# EAGLE design MotorSpeedController (EAGLE 9.4.0)
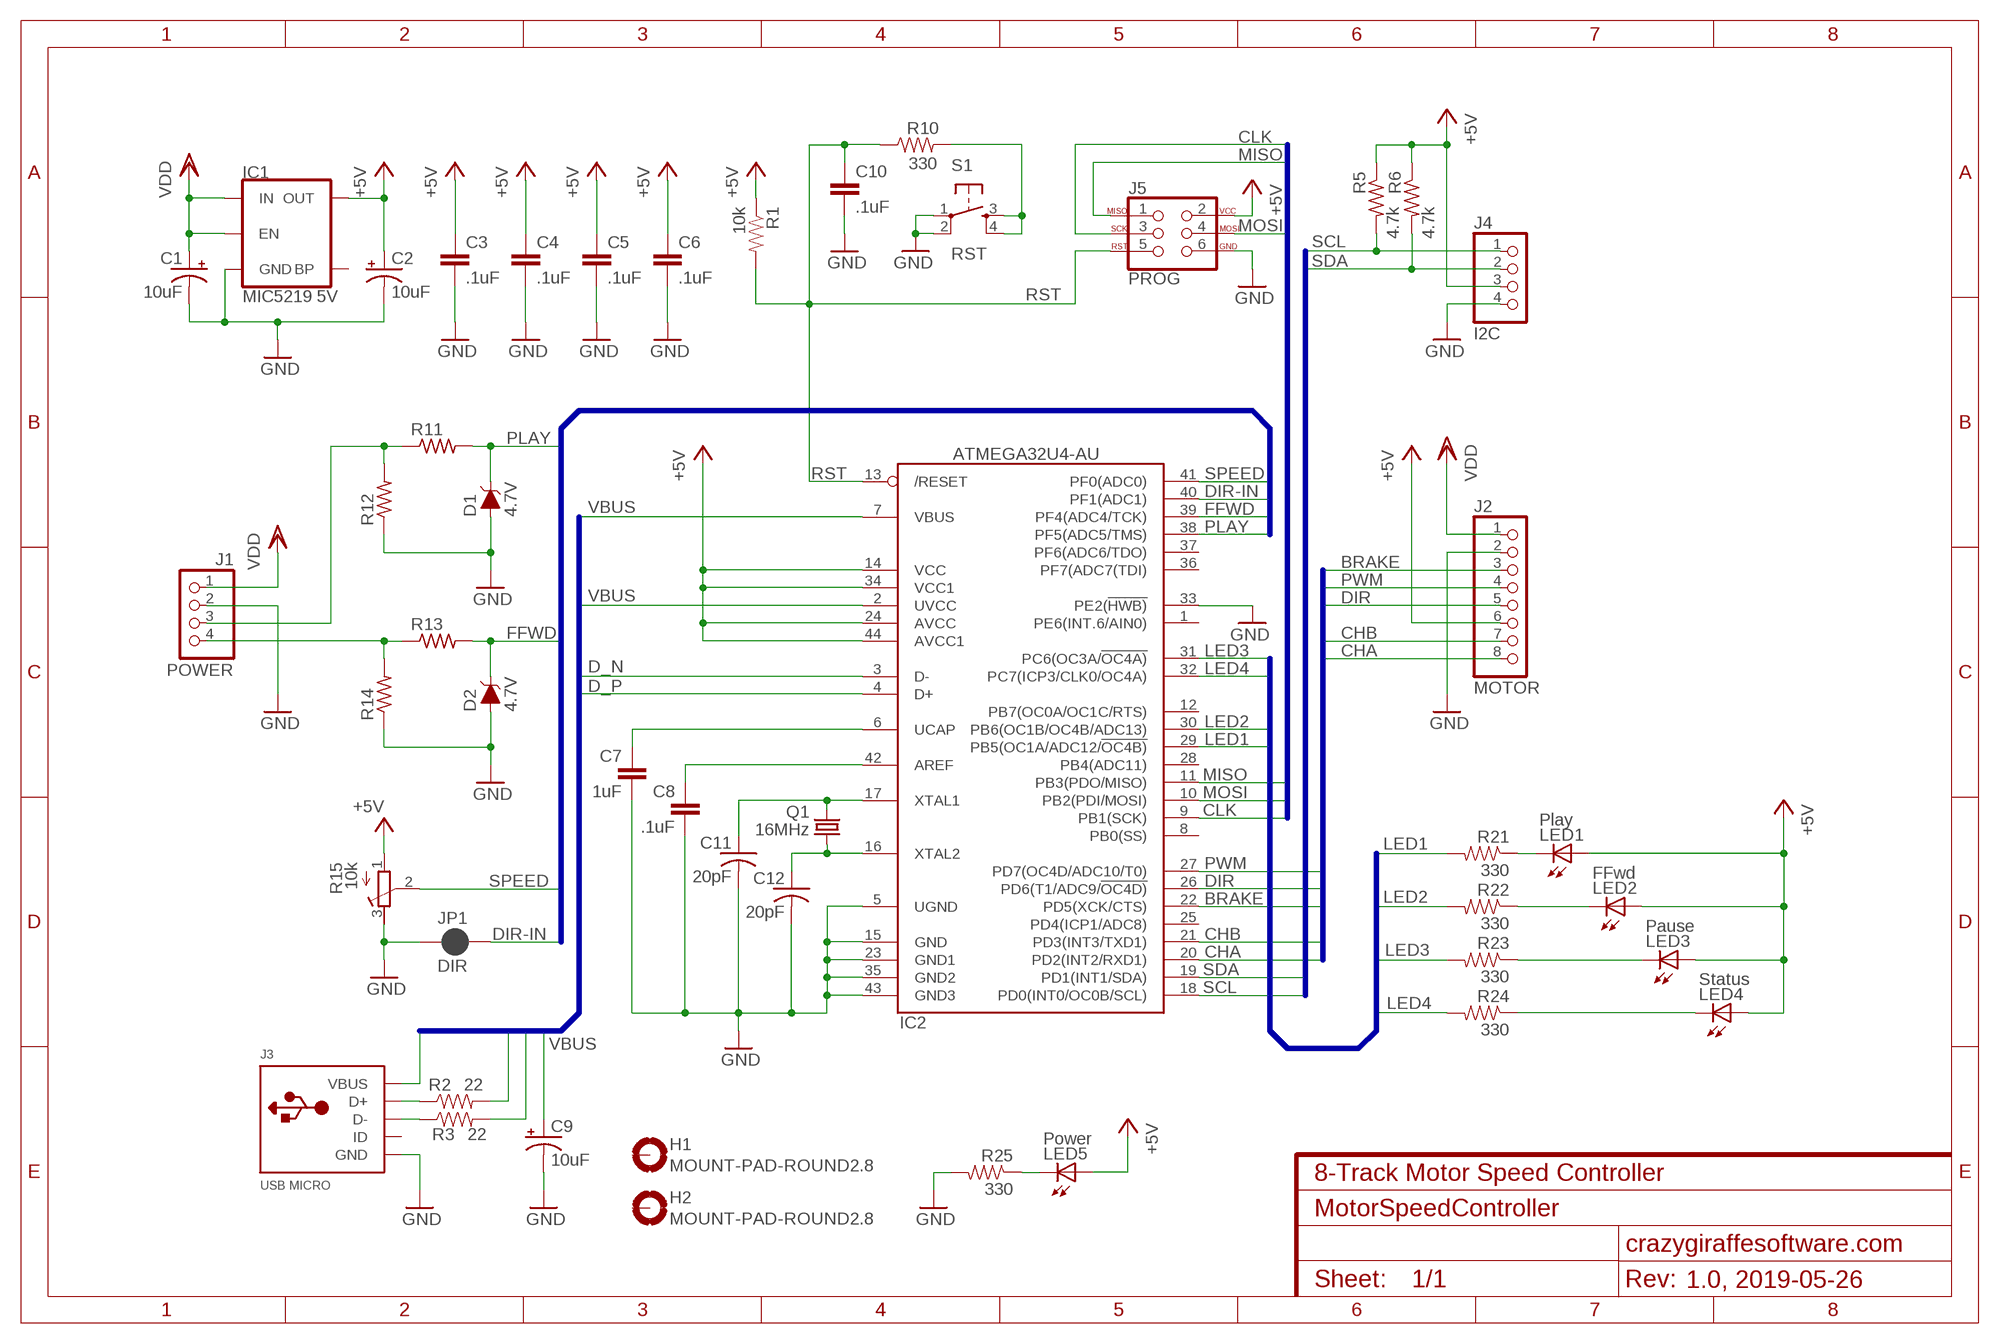
[diagram p0: schematic, sheet 1]
FRAME1 (FRAME-A4L): CNAME: 8-Track Motor Speed Controller; CREVISION: 1.0, 2019-05-26; DESIGNER: crazygiraffesoftware.com

## Parts
C1  10uF  CPOL-USB  [PANASONIC_B]
C2  10uF  CPOL-USB  [PANASONIC_B]
C3  .1uF  CAP0603-CAP  [0603-CAP]
C4  .1uF  CAP0603-CAP  [0603-CAP]
C5  .1uF  CAP0603-CAP  [0603-CAP]
C6  .1uF  CAP0603-CAP  [0603-CAP]
C7  1uF  CAP0603-CAP  [0603-CAP]
C8  .1uF  CAP0603-CAP  [0603-CAP]
C9  10uF  CPOL-USB  [PANASONIC_B]
C10  .1uF  CAP0603-CAP  [0603-CAP]
C11  20pF  C-US025-030X050  [C025-030X050]
C12  20pF  C-US025-030X050  [C025-030X050]
D1  4.7V  DIODE-ZENER-BZT52C3V6S  [SOD-323]
D2  4.7V  DIODE-ZENER-BZT52C3V6S  [SOD-323]
H1  MOUNT-PAD-ROUND2.8  [2,8-PAD]
H2  MOUNT-PAD-ROUND2.8  [2,8-PAD]
IC1  MIC5219 5V  V_REG_MIC52195V  [SOT23-5]
IC2  ATMEGA32U4-AU  [TQFP44]
J1  POWER  PINHD-1X4  [1X04]
J2  MOTOR  PINHD-1X8  [1X08]
J3  USB MICRO  MICROBUILDER_USB_MICRO_20329_V2  [MICROBUILDER_4UCONN_20329_V2]
J4  I2C  PINHD-1X4  [1X04]
J5  PROG  AVR_SPI_PROG_3X2PTH  [2X3]
JP1  DIR  JUMPER-SMT_2_NC_PASTE_SILK  [SMT-JUMPER_2_NC_PASTE_SILK]
LED1  Play  LED0603  [LED-0603]
LED2  FFwd  LED0603  [LED-0603]
LED3  Pause  LED0603  [LED-0603]
LED4  Status  LED0603  [LED-0603]
LED5  Power  LED0603  [LED-0603]
Q1  16MHz  CRYSTALHC49S  [HC49/S]
R1  10k  RESISTOR0603-RES  [0603-RES]
R2  22  RESISTOR0603-RES  [0603-RES]
R3  22  RESISTOR0603-RES  [0603-RES]
R5  4.7k  R-US_R0603  [R0603]
R6  4.7k  R-US_R0603  [R0603]
R10  330  RESISTOR0603-RES  [0603-RES]
R11  R-US_R0603  [R0603]
R12  R-US_R0603  [R0603]
R13  R-US_R0603  [R0603]
R14  R-US_R0603  [R0603]
R15  10k  R-TRIMM3296Y  [RTRIM3296Y]
R21  330  RESISTOR0603-RES  [0603-RES]
R22  330  RESISTOR0603-RES  [0603-RES]
R23  330  RESISTOR0603-RES  [0603-RES]
R24  330  RESISTOR0603-RES  [0603-RES]
R25  330  RESISTOR0603-RES  [0603-RES]
S1  RST  TAC_SWITCHSMD  [TACTILE_SWITCH_SMD]

## Nets
+5V: C2.+ C3.1 C4.1 C5.1 C6.1 IC1.5(OUT) IC2.14(VCC) IC2.24(AVCC) IC2.34(VCC1) IC2.44(AVCC1) J2.6 J4.3 J5.2 LED1.A LED2.A LED3.A LED4.A LED5.A R1.1 R5.1 R6.1 R15.1(A)
+PWR: C1.+ IC1.1(IN) IC1.3(EN) J1.1 J2.1 ; supply symbol labelled VDD
BRAKE: IC2.22(PD5(XCK/CTS)) J2.3
CD_N [diff pairs]: J3.D- R3.1
CD_P [diff pairs]: J3.D+ R2.1
CHA: IC2.20(PD2(INT2/RXD1)) J2.8
CHB: IC2.21(PD3(INT3/TXD1)) J2.7
CLK: IC2.9(PB1(SCK)) J5.3
D_N [diff pairs]: IC2.3(D-) R3.2
D_P [diff pairs]: IC2.4(D+) R2.2
DIR: IC2.26(PD6(T1/ADC9/!OC4D)) J2.5
DIR-IN: IC2.40(PF1(ADC1)) JP1.2
FFWD: D2.C IC2.39(PF4(ADC4/TCK)) R13.2
GND: C1.- C2.- C3.2 C4.2 C5.2 C6.2 C7.2 C8.2 C9.- C10.2 C11.2 C12.2 D1.A D2.A IC1.2(GND) IC2.5(UGND) IC2.15(GND) IC2.23(GND1) IC2.33(PE2(!HWB)) IC2.35(GND2) IC2.43(GND3) J1.2 J2.2 J3.BASE@1(GND) J3.BASE@2(GND) J3.GND J3.SPRT@1(GND) J3.SPRT@2(GND) J3.SPRT@3(GND) J3.SPRT@4(GND) J4.4 J5.6 JP1.1 R12.1 R14.1 R15.3(E) R25.2 S1.1 S1.2
LED1: IC2.29(PB5(OC1A/ADC12/!OC4B)) R21.2
LED2: IC2.30(PB6(OC1B/OC4B/ADC13)) R22.2
LED3: IC2.31(PC6(OC3A/!OC4A)) R23.2
LED4: IC2.32(PC7(ICP3/CLK0/OC4A)) R24.2
MISO: IC2.11(PB3(PDO/MISO)) J5.1
MOSI: IC2.10(PB2(PDI/MOSI)) J5.4
N$1: LED3.C R23.1
N$2: C8.1 IC2.42(AREF)
N$3: C11.1 IC2.17(XTAL1) Q1.2
N$4: R10.2 S1.3 S1.4
N$5: C7.1 IC2.6(UCAP)
N$6: LED4.C R24.1
N$7: C12.1 IC2.16(XTAL2) Q1.1
N$10: J1.4 R13.1 R14.2
N$11: LED5.C R25.1
N$13: J1.3 R11.1 R12.2
N$20: LED1.C R21.1
PLAY: D1.C IC2.38(PF5(ADC5/TMS)) R11.2
PWM: IC2.27(PD7(OC4D/ADC10/T0)) J2.4
R22: LED2.C R22.1
RST: C10.1 IC2.13(/RESET) J5.5 R1.2 R10.1
SCL: IC2.18(PD0(INT0/OC0B/SCL)) J4.1 R5.2
SDA: IC2.19(PD1(INT1/SDA)) J4.2 R6.2
SPEED: IC2.41(PF0(ADC0)) R15.2(S)
VBUS: C9.+ IC2.2(UVCC) IC2.7(VBUS) J3.VBUS
Unconnected: H1.B2,8(MOUNT) H2.B2,8(MOUNT) IC1.4(BP) IC2.1(PE6(INT.6/AIN0)) IC2.8(PB0(SS)) IC2.12(PB7(OC0A/OC1C/RTS)) IC2.25(PD4(ICP1/ADC8)) IC2.28(PB4(ADC11)) IC2.36(PF7(ADC7(TDI)) IC2.37(PF6(ADC6/TDO)) J3.ID

## Buses
INS:DIR-IN,FFWD,PLAY,SPEED
MOTOR:BRAKE,CHA,CHB,DIR,PWM
SPI:CLK,CS,MISO,MOSI
I2C:SCL,SDA
LEDS:LED1,LED2,LED3,LED4
USB:D_N,D_P,VBUS

## Library data of the parts
C1 C2 C9 = rcl:CPOL-US: POLARIZED CAPACITOR, American symbol; SPICEPREFIX: C
C3-C8 C10 = SparkFun-Passives:CAP: Capacitor Standard 0603 ceramic capacitor, and 0.1" leaded capacitor.
C11 C12 = adafruit:C-US: CAPACITOR, American symbol
D1 D2 = SparkFun-DiscreteSemi:DIODE-ZENER: Zener Diode A Zener diode allows current to flow from its anode to its cathode like a normal semiconductor diode, but it also permits current to flow in the reverse direction when its "Zener voltage" is reached. - WIkipedia; PROD_ID: DIO-08199; SPICEPREFIX: D; VALUE: 3.6V
H1 H2 = holes:MOUNT-PAD-ROUND: MOUNTING PAD, round
IC1 = SparkFun-IC-Power:V_REG_MIC5219: V_REG MIC5219 Standard 3.3V and 5V 500mA LDO voltage regulator in SOT-23 layout. Micrel part MIC5219. BP (by-pass) pin is used to lower output noise with 470pF cap, may be left open.; PROD_ID: VREG-10107
IC2 = adafruit:ATMEGA32U4: http://www.ladyada.net/library/eagle
J1 = pinhead:PINHD-1X4: PIN HEADER; SPICEPREFIX: E
J2 = pinhead:PINHD-1X8: PIN HEADER
J3 = NidecController:MICROBUILDER_USB: USB Connectors USBMINIB - Surface Mount Female Mini-B USB Connector 4UConnector: 06564
J4 = pinhead:PINHD-1X4: PIN HEADER
J5 = SparkFun-Connectors:AVR_SPI_PROG_3X2: AVR ISP 6 Pin This is the reduced ISP connector for AVR programming. Common on Arduino. This footprint will take up less PCB space and can be used with a 10-pin to 6-pin adapter such as SKU: BOB-08508 **Special note about "TEST_POINT" package. The stop mask is on the top side, so if you want your programming test points to be on the bottom of your board, make sure to place this package on the bottom side of the board. This also ensure that the orientation to program from the bottom side will be correct. SparkFun Products: SparkFun ISP Pogo Adapter <https://www.sparkfun.com/products/11591> - NS Tiny AVR Programmer <https://www.sparkfun.com/products/11801> -PTH
JP1 = SparkFun-Jumpers:JUMPER-SMT_2_NC_PASTE: Normally closed solder jumper This jumper has an aperture in the stencil to allow solder paste to bridge the split in the wire so it's normally closed (NC). Wick off the solder to open the connection. Reapply solder to reclose the connection.; SPICEPREFIX: B
LED1-LED5 = SparkFun-LED:LED: LEDs Standard schematic elements and footprints for 5mm, 3mm, 1206, and 0603 sized LEDs. 5mm - Spark Fun Electronics SKU : COM-00529 (and others)
Q1 = adafruit:CRYSTAL: CRYSTAL; OC_FARNELL: 1667008; OC_NEWARK: unknown
R1-R3 R10 R21-R25 = SparkFun-Passives:RESISTOR: Resistor Basic schematic elements and footprints for 0603, 1206, and PTH resistors.
R5 R6 R11-R14 = rcl:R-US_: RESISTOR, American symbol; SPICEPREFIX: R
R15 = rcl:R-TRIMM: Trimm resistor; SPICEMODEL: X; SPICEPREFIXL: POT
S1 = SparkFun-Electromechanical:TAC_SWITCH: Momentary Switch Button commonly used for reset or general input. Spark Fun Electronics SKU : COM-00097

## Net classes
1 vcc: width 0.254 mm
2 gnd: width 0.254 mm
3 diff pairs: width 0.152 mm

## Board
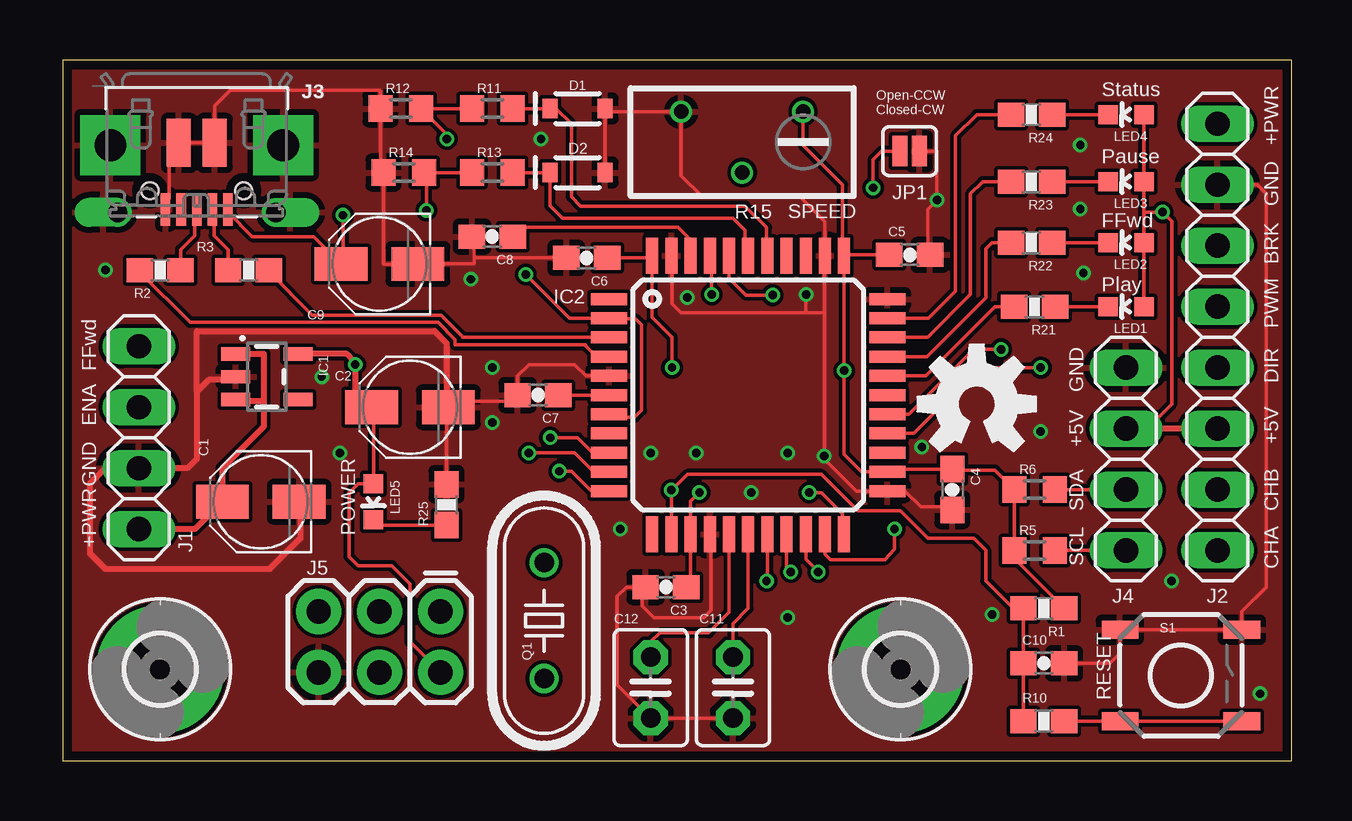
[diagram p1: board, top side]
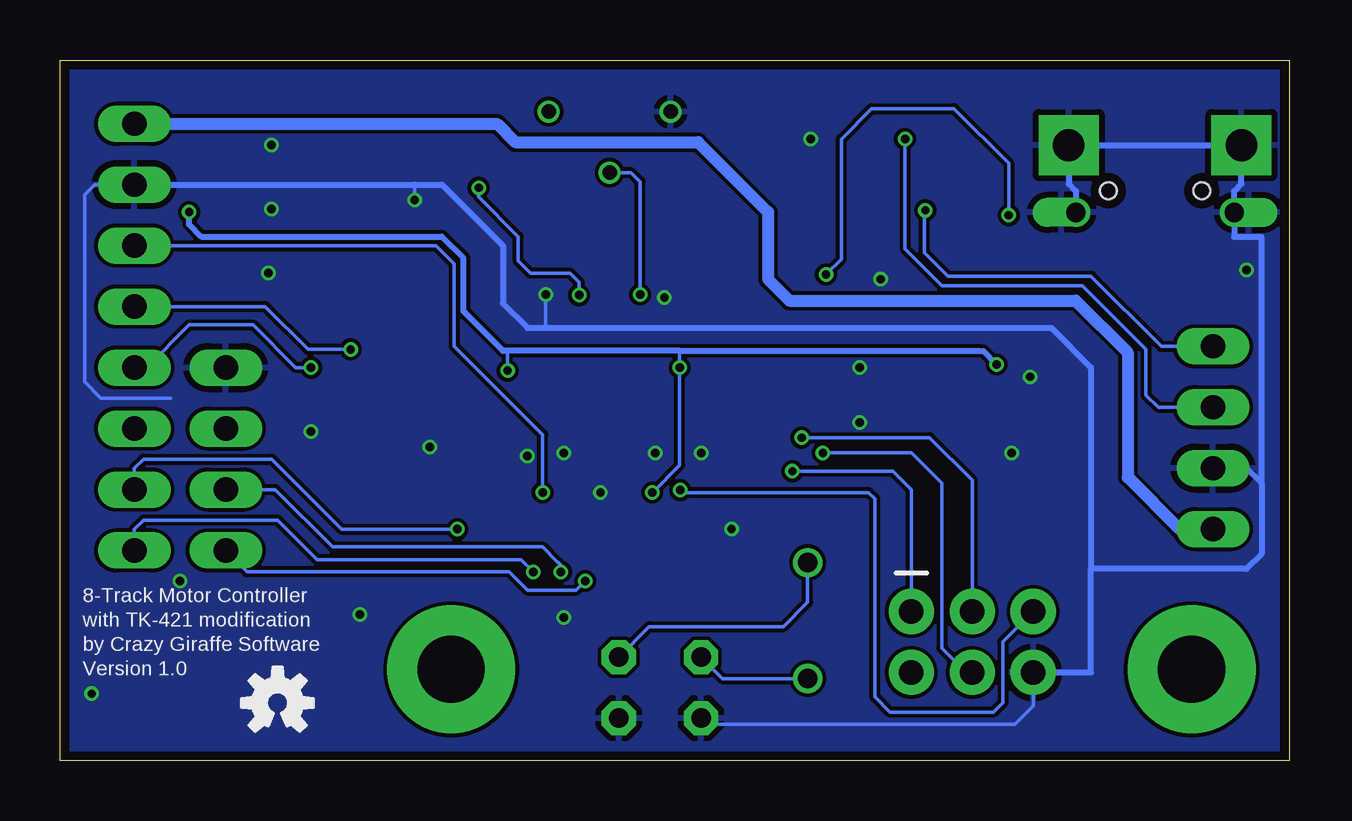
[diagram p2: board, bottom side, seen from below]

Size 51.23 x 29.2 mm. Coordinates in mm from the lower left corner, seen from the top.
Outline: 0,0 51.23,0 51.23,29.2 0,29.2 0,0
Copper layers (1*16): Top 0.035559375mm / dielectric 1.6mm / Bottom 0.035559375mm
Design rules "oshpark-2layer": minimum track width 6mil, minimum drill 10mil, track to track 6mil, track to pad 6mil, pad to pad 6mil, via to via 6mil, smd to smd 6mil, copper to edge 15mil, drill to drill 6mil, minimum pad ring 5mil, minimum via ring 5mil, stop-mask expansion 2.5mil, vias tented up to drill 0mil, thermal gap 10mil

### Footprints (pad centres in the part's own frame; a part is rotated, then mirrored left to right if it is on the bottom)
PANASONIC_B = smd 2.2 x 1.4: + 1.6,0; - -1.6,0
0603-CAP = smd 1.1 x 1: 1 -0.85,0; 2 0.85,0
C025-030X050 = drill 0.813 pad 1.422 octagon: 1 -1.27,0; 2 1.27,0
SOD-323 = smd 0.63 x 0.83: A 1.15,0; C -1.15,0
2,8-PAD = drill 2.8 pad 5.334: B2,8 0,0
SOT23-5 = smd 0.55 x 1.2: 1 -0.95,-1.3; 2 0,-1.3; 3 0.95,-1.3; 4 0.95,1.3; 5 -0.95,1.3
TQFP44 = smd 1.5 x 0.5: 1 -5.8,4; 2 -5.8,3.2; 3 -5.8,2.4; 4 -5.8,1.6; 5 -5.8,0.8; 6 -5.8,0; 7 -5.8,-0.8; 8 -5.8,-1.6; 9 -5.8,-2.4; 10 -5.8,-3.2; 11 -5.8,-4; 23 5.8,-4; 24 5.8,-3.2; 25 5.8,-2.4; 26 5.8,-1.6; 27 5.8,-0.8; 28 5.8,0; 29 5.8,0.8; 30 5.8,1.6; 31 5.8,2.4; 32 5.8,3.2; 33 5.8,4 | smd 0.5 x 1.5: 12 -4,-5.8; 13 -3.2,-5.8; 14 -2.4,-5.8; 15 -1.6,-5.8; 16 -0.8,-5.8; 17 0,-5.8; 18 0.8,-5.8; 19 1.6,-5.8; 20 2.4,-5.8; 21 3.2,-5.8; 22 4,-5.8; 34 4,5.8; 35 3.2,5.8; 36 2.4,5.8; 37 1.6,5.8; 38 0.8,5.8; 39 0,5.8; 40 -0.8,5.8; 41 -1.6,5.8; 42 -2.4,5.8; 43 -3.2,5.8; 44 -4,5.8
1X04 = drill 1.016 long: 1 -3.81,0; 2 -1.27,0; 3 1.27,0; 4 3.81,0
1X08 = drill 1.016 long: 1 -8.89,0; 2 -6.35,0; 3 -3.81,0; 4 -1.27,0; 5 1.27,0; 6 3.81,0; 7 6.35,0; 8 8.89,0
MICROBUILDER_4UCONN_20329_V2 = smd 1 x 2: BASE@1 -0.75,-2; BASE@2 0.75,-2 | smd 0.4 x 1.35: D+ 0,0.775; D- -0.65,0.775; GND 1.3,0.775; ID 0.65,0.775; VBUS -1.3,0.775 | drill 0.8 pad 1.2 offset: SPRT@1 -3.3,0.9; SPRT@2 3.3,0.9 | drill 1.321 pad 2.5 square: SPRT@3 -3.6,-1.9; SPRT@4 3.6,-1.9 | hole 0.7: -1.95,0; 1.95,0
2X3 = drill 1.016 pad 1.88: 1 0,0; 2 0,2.54; 3 2.54,0; 4 2.54,2.54; 5 5.08,0; 6 5.08,2.54
SMT-JUMPER_2_NC_PASTE_SILK = smd 0.635 x 1.27: 1 -0.406,0; 2 0.406,0
LED-0603 = smd 0.8 x 0.8: A 0,-0.75; C 0,0.75
HC49/S = drill 0.813: 1 -2.413,0; 2 2.413,0
0603-RES = smd 1.1 x 1: 1 -0.85,0; 2 0.85,0
R0603 = smd 1 x 1.1: 1 -0.85,0; 2 0.85,0
RTRIM3296Y = drill 0.61: 1 1.27,-2.54; 2 -1.27,0; 3 1.27,2.54
TACTILE_SWITCH_SMD = smd 1.524 x 0.762: 1 -2.54,1.905; 2 2.54,1.905; 3 -2.54,-1.905; 4 2.54,-1.905

### Placement (x,y rotation side)
C1  8.26,10.79 180 top
C2  14.48,14.73 180 top
C3  25.15,7.24 180 top
C4  37.08,11.3 270 top
C5  35.31,21.08 0 top
C6  21.84,20.95 180 top
C7  19.81,15.24 180 top
C8  17.91,21.84 180 top
C9  13.21,20.7 180 top
C10  40.89,4.06 0 top
C11  27.94,3.05 270 top
C12  24.51,3.05 270 top
D1  21.46,27.18 0 top
D2  21.46,24.51 0 top
H1  4.06,3.81 0 top
H2  34.92,3.81 0 top
IC1  8.51,16 270 top
IC2  28.57,15.24 0 top
J1  3.17,13.46 90 top
J2  48.13,17.65 270 top
J3  5.59,23.75 180 top
J4  44.32,12.57 90 top
J5  15.75,6.22 180 top
JP1  35.31,25.4 180 top
LED1  44.32,18.92 90 top
LED2  44.32,21.59 90 top
LED3  44.32,24.13 90 top
LED4  44.32,26.92 90 top
LED5  12.95,10.79 180 top
Q1  20.07,5.84 90 top
R1  40.89,6.35 180 top
R2  4.06,20.45 180 top
R3  7.75,20.45 0 top
R5  40.51,8.76 0 top
R6  40.51,11.3 0 top
R10  40.89,1.65 0 top
R11  17.91,27.18 0 top
R12  14.1,27.18 0 top
R13  17.91,24.51 0 top
R14  14.22,24.51 0 top
R15  28.32,25.78 90 top
R21  40.51,18.92 180 top
R22  40.39,21.59 180 top
R23  40.39,24.13 180 top
R24  40.39,26.92 180 top
R25  16,10.67 90 top
S1  46.61,3.56 0 top
U$1  [OSHW-LOGO-M]  38.1,14.86 0 top
U$2  [OSHW-LOGO-S]  42.16,2.41 0 bottom

### Tracks (layer width: path | path; a pad name or v marks a point on that pad's centre or on a via)
+5V  (via drill 0.35)
  Top 0.152: C5.1 32.62,21.08 IC2.34 | LED1.A LED2.A 45.07,22.86 | 45.07,22.86 LED3.A LED4.A | IC2.34 v32.58,16.26 32.58,12.76 33.3,12.04 IC2.24 34.49,12.15 C4.1 37.04,12.11 38.86,12.11 R6.1 R5.1 39.66,8.43 R1.1 | IC2.34 32.51,21.1 32.51,24 30.86,25.65 R15.1 | C3.1 26.18,7.42 IC2.14 26.18,10.81 v26.54,11.18 | C2.+ 12.95,14.66 LED5.A 12.31,11.54 11.94,11.18 11.94,8.51 12.32,8.13 13.72,8.13 14.48,7.37 14.48,4.95 J5.2 | v25.4,16.38 25.4,17.65 24.57,18.48 IC2.44 24.49,20.95 C6.1 | 45.21,13.84 46.23,14.86 46.23,22.48 v45.85,22.86 45.07,22.86
  Top 0.254: 45.21,13.84 J4.3 J2.6 | C2.+ 12.19,15.42 v12.19,16.51 12.16,16.55 12.16,16.64 11.84,16.95 IC1.5
  Bottom 0.152: v26.54,11.18 25.4,12.32 v25.4,16.38 25.4,17.08 | v32.58,16.26 32.58,17.02 32.64,17.08
  Bottom 0.254: v12.19,16.51 12.75,17.07 12.89,17.08 25.4,17.08 32.64,17.08 32.77,17.08 34.42,18.73 34.42,20.95 35.31,21.84 45.34,21.84 45.85,22.35 v45.85,22.86
+PWR
  Top 0.254: J1.1 5.51,9.65 C1.+ 6.66,12.19 8.38,13.92 8.38,14.99 | IC1.1 8.38,16.95 8.38,14.99 | 8.38,14.99 7.28,14.99 IC1.3
  Bottom 0.508: J2.1 33.02,26.54 32.26,25.78 24.64,25.78 21.72,22.86 21.72,20.07 20.83,19.18 8.89,19.18 6.73,17.02 6.73,11.81 4.57,9.65 J1.1
BRAKE  (via drill 0.35)
  Top 0.152: IC2.22 32.51,9.5 32.51,10.29 31.62,11.18 v31.11,11.18
  Bottom 0.152: J2.3 35.56,21.46 34.8,20.7 34.8,17.27 31.11,13.59 v31.11,11.18
CD_N
  Top 0.152: R3.1 6.9,21.3 6.31,21.89 6.31,22.9 J3.D-
CD_P
  Top 0.152: R2.1 4.91,21.3 5.5,21.89 5.5,22.86 5.59,22.95 J3.D+
CHA  (via drill 0.35)
  Top 0.152: v31.5,7.87 30.98,8.39 IC2.20
  Bottom 0.152: J2.8 48.13,9.65 47.75,10.03 42.16,10.03 40.51,8.38 32,8.38 v31.5,7.87
CHB  (via drill 0.35)
  Top 0.152: IC2.21 31.77,8.61 32,8.38 34.28,8.38 34.67,8.8 v34.67,9.65
  Bottom 0.152: J2.7 48.13,12.19 47.75,12.57 42.42,12.57 39.5,9.65 v34.67,9.65
CLK  (via drill 0.35)
  Top 0.152: IC2.9 22.09,12.84 21.46,13.46 v20.32,13.46
  Bottom 0.152: J5.3 13.21,11.68 14.99,13.46 v20.32,13.46
D_N
  Top 0.152: R3.2 8.6,20.38 10.41,18.57 15.77,18.57 16.66,17.67 16.66,17.64 IC2.3
D_P
  Top 0.152: R2.2 3.21,20.36 5.31,18.26 15.64,18.26 16.36,17.55 16.36,17.34 21.8,17.34 21.8,17.3 22.18,16.91 22.77,16.91 IC2.4
DIR  (via drill 0.35)
  Top 0.152: IC2.26 35.48,13.64 38.23,16.38 v40.77,16.38
  Bottom 0.152: v40.77,16.38 41.4,16.38 43.18,18.16 45.85,18.16 47.62,16.38 J2.5
DIR-IN  (via drill 0.35)
  Top 0.152: JP1.2 34.14,25.4 33.78,25.04 v33.78,23.88 | v29.59,19.4 28.48,19.4 27.77,20.1 IC2.40
  Bottom 0.152: v33.78,23.88 33.78,23.5 32.13,21.84 32.13,20.83 31.62,20.32 29.97,20.32 29.59,19.94 v29.59,19.4
FFWD
  Top 0.152: IC2.39 28.45,21.17 28.45,22.1 27.94,22.61 20.83,22.61 20.31,23.12 20.31,24.38 | 20.31,24.38 D2.C | R13.2 20.19,24.51 20.31,24.38
GND  (via drill 0.35)
  Top 0.152: C4.2 36.96,10.58 35.77,10.58 35.12,11.24 IC2.23 33.08,11.24 31.75,12.57 v31.75,12.7 31.75,18.67 | IC2.33 34.38,19.3 | J2.2 49.78,24 50.16,23.62 50.16,7.24 49.15,6.22 S1.2 S1.1 44.07,4.48 43.65,4.06 C10.2 | IC2.43 25.4,21.02 25.4,19.05 25.78,18.67 30.99,18.67 | 31.75,21.05 31.75,18.67 | D2.A D1.A 22.74,27.05 R15.3 25.78,24.38 26.67,23.5 30.73,23.5 31.77,22.45 IC2.35 | IC2.5 21.81,16.04 21.34,16.51 19.43,16.51 18.96,16.04 C7.2 18.96,14.99 16.33,14.99 C2.- 16,14.66 16,14.61 R25.2 | C11.2 C12.2 23.11,3.17 23.11,6.86 23.5,7.24 C3.2 24.15,7.09 24.15,6.46 24.64,5.97 26.73,5.97 27.03,6.26 27.03,9.39 IC2.15 | 31.75,18.67 30.99,18.67 | 30.99,18.67 v30.99,19.43 | C5.2 36.07,21.17 36.07,22.99 v36.45,23.37 36.45,25.4 JP1.1 | J3.GND 4.29,23.26 4.45,23.41 4.45,25.36 J3.BASE@2 J3.BASE@1 6.34,27.29 6.99,27.94 13.21,27.94 13.25,27.9 R12.1 13.25,24.64 R14.1 13.37,20.7 13.38,20.69 C9.- 17.14,20.7 17.14,20.95 | 17.14,20.95 C6.2 | C8.2 17.14,21.84 17.14,20.95
  Top 0.203: IC2.35 31.75,21.05
  Top 0.254: IC1.2 7.08,15.88 6.1,15.88 5.59,15.37 | 5.59,15.37 5.59,12.57 5.21,12.19 J1.2 1.78,12.19 1.14,11.56 1.14,8.64 1.78,8 8.64,8 9.91,9.27 9.91,10.74 C1.- | 5.59,15.37 5.59,17.91 15.49,17.91 16,17.4 16,14.61
  Bottom 0.152: 46.61,15.11 49.53,15.11 50.21,15.79 50.21,16.39 50.21,23.58 49.78,24 48.01,24 | v30.99,19.43 30.99,18.16 30.86,18.03 | C12.2 24.26,1.52 11.43,1.52 10.67,2.29 J5.6 | v36.45,23.37 36.45,24
  Bottom 0.254: 48.01,24 J2.2 36.45,24 35.31,24 32.77,21.46 32.77,19.05 31.75,18.03 30.86,18.03 9.91,18.03 8.26,16.38 8.26,8 | J1.2 1.78,12.19 1.14,11.56 | 1.14,11.56 1.14,8.64 1.78,8 8.26,8 | 10.16,3.68 J5.6 8.26,3.68 8.26,8 | 1.14,11.56 1.14,21.83 2.29,21.83 J3.SPRT@2 2.29,23.74 1.99,24.04 J3.SPRT@4 J3.SPRT@3 9.19,24.04 8.89,23.74 J3.SPRT@1
  other vias: 26.04,19.3 19.94,25.91 17.02,20.07 1.78,20.45 11.56,12.83 10.79,16 17.91,14.1 17.91,16.38 24.51,12.83 23.24,9.65 26.42,12.83 30.23,12.83 30.23,5.97 38.73,6.1 40.77,13.72 35.81,13.08 28.7,11.18 46.23,7.49 49.91,2.79 42.42,25.65 42.42,22.99 42.55,20.32
  pour Bottom: 0,29.21 0,0 51.31,0 51.31,29.21
  pour Top: 0,29.21 0,0 51.31,0 51.31,29.21
LED1
  Top 0.152: IC2.29 35.98,16.04 38.86,18.92 R21.2
LED2
  Top 0.152: R22.2 38.73,21.59 38.48,21.34 38.48,19.3 36.02,16.84 IC2.30
LED3
  Top 0.152: R23.2 38.35,24.13 37.85,23.62 37.85,19.43 36.05,17.64 IC2.31
LED4
  Top 0.152: R24.2 38.1,26.92 37.21,26.04 37.21,19.56 36.09,18.44 IC2.32
MISO  (via drill 0.35)
  Top 0.152: v20.7,12.06 21.21,12.06 22.03,11.24 IC2.11
  Bottom 0.152: J5.1 15.75,11.3 16.51,12.06 v20.7,12.06
MOSI  (via drill 0.35)
  Top 0.152: IC2.10 22.12,12.04 21.34,12.83 v19.43,12.83
  Bottom 0.152: v19.43,12.83 15.75,12.83 14.48,11.56 14.48,4.7 13.46,3.68 J5.4
N$1
  Top 0.152: LED3.C R23.1
N$2
  Top 0.152: C8.1 19.14,22.23 25.65,22.23 25.84,22.04 26.04,21.84 26.18,21.7 IC2.42
N$3
  Top 0.152: C11.1 27.94,5.71 28.57,6.35 IC2.17
  Bottom 0.152: C11.1 26.67,5.59 21.08,5.59 20.07,6.6 Q1.2
N$4
  Top 0.152: S1.4 S1.3 R10.2
N$5
  Top 0.152: IC2.6 C7.1
N$6
  Top 0.152: LED4.C R24.1
N$7
  Top 0.152: IC2.16 27.77,6.18 26.92,5.33 24.89,5.33 24.51,4.95 C12.1
  Bottom 0.152: C12.1 23.62,3.43 Q1.1
N$10  (via drill 0.35)
  Top 0.152: R14.2 15.24,24.51 | 15.24,24.51 R13.1 | v15.16,22.94 15.16,24.43 15.24,24.51
  Bottom 0.152: J1.4 5.33,17.27 8.26,20.19 14.22,20.19 15.19,21.16 15.19,22.91 v15.16,22.94
N$11
  Top 0.152: LED5.C 13.18,9.82 R25.1
N$13  (via drill 0.35)
  Top 0.152: R11.1 R12.2 16.01,26.12 v16.01,25.91
  Bottom 0.152: v16.01,25.91 16.01,21.34 14.46,19.79 8.62,19.79 5.97,17.14 5.97,15.24 5.46,14.73 J1.3
N$20
  Top 0.152: LED1.C R21.1
PLAY
  Top 0.152: IC2.38 29.34,21.08 29.34,22.23 28.45,23.11 21.59,23.11 21.21,23.5 21.21,26.54 20.57,27.18 D1.C R11.2
PWM  (via drill 0.35)
  Top 0.152: IC2.27 35.27,14.44 37.97,17.14 v39.12,17.14
  Bottom 0.152: v39.12,17.14 40.89,17.14 42.67,18.92 J2.4
R22
  Top 0.152: LED2.C R22.1
RST  (via drill 0.35)
  Top 0.152: IC2.13 v25.38,11.28 26.04,11.94 31.62,11.94 33.15,10.41 34.92,10.41 36.07,9.27 37.97,9.27 38.48,8.76 38.48,7.49 39.62,6.35 R1.2 C10.1 R10.1
  Bottom 0.152: J5.5 11.94,4.95 11.94,2.41 12.32,2.03 16.64,2.03 17.27,2.67 17.27,10.92 17.53,11.18 25.27,11.18 v25.38,11.28
SCL  (via drill 0.35)
  Top 0.152: v29.34,7.49 29.38,7.54 IC2.18 | J4.1 R5.2
  Bottom 0.152: v29.34,7.49 29.72,7.11 31.75,7.11 32.51,7.87 43.43,7.87 J4.1
SDA  (via drill 0.35)
  Top 0.152: IC2.19 30.18,8.05 v30.35,7.87 | J4.2 R6.2
  Bottom 0.152: J4.2 42.26,11.3 39.88,8.92 31.12,8.92 30.49,8.28 30.48,8.28 30.35,8.16 v30.35,7.87
SPEED  (via drill 0.35)
  Top 0.152: 27.05,20.96 v27.05,19.43
  Top 0.203: IC2.41 27.05,20.96
  Bottom 0.152: v27.05,19.43 27.05,24.13 27.43,24.51 R15.2
VBUS  (via drill 0.35)
  Top 0.152: IC2.7 22.9,14.31 23.84,14.31 24.13,14.61 24.13,18.16 23.88,18.41 22.8,18.41 IC2.2 21.13,18.44 v19.3,20.27 | J3.VBUS 6.89,22.86 7.9,21.84 10.46,21.84 C9.+ 11.68,20.78 v11.68,22.73
  Bottom 0.152: v19.3,20.27 18.67,20.9 18.67,25.91 17.4,27.18 13.97,27.18 11.68,24.89 v11.68,22.73

### Text on the board
tNames: Status | Open-CCW / Closed-CW | +PWR | Pause | SPEED | GND | FFwd | BRK | Play | PWM | FFwd | DIR | GND | ENA | +5V | +5V | GND | SDA | CHB | +PWR | POWER | SCL | CHA | RESET
bNames: 8-Track Motor Controller | with TK-421 modification | by Crazy Giraffe Software | Version 1.0